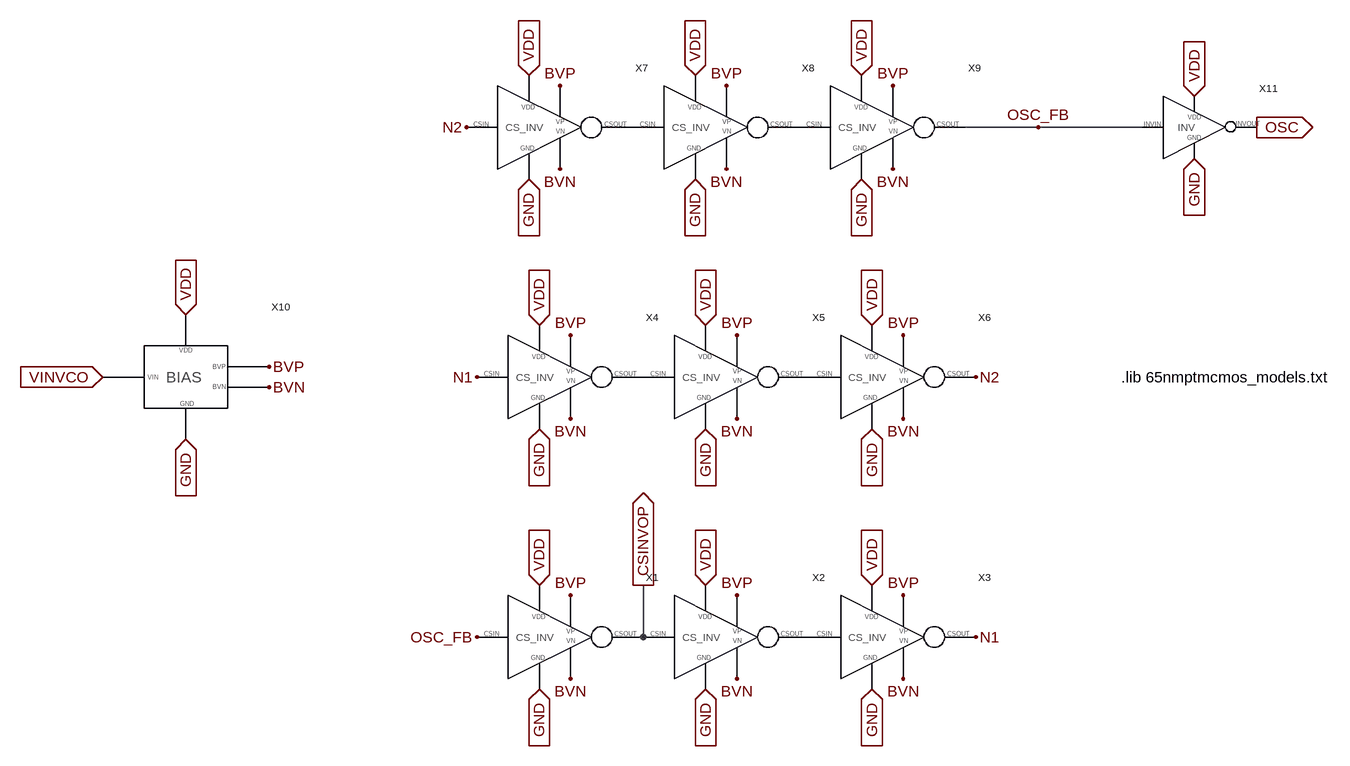
[diagram p0: schematic VCO_9.asc]
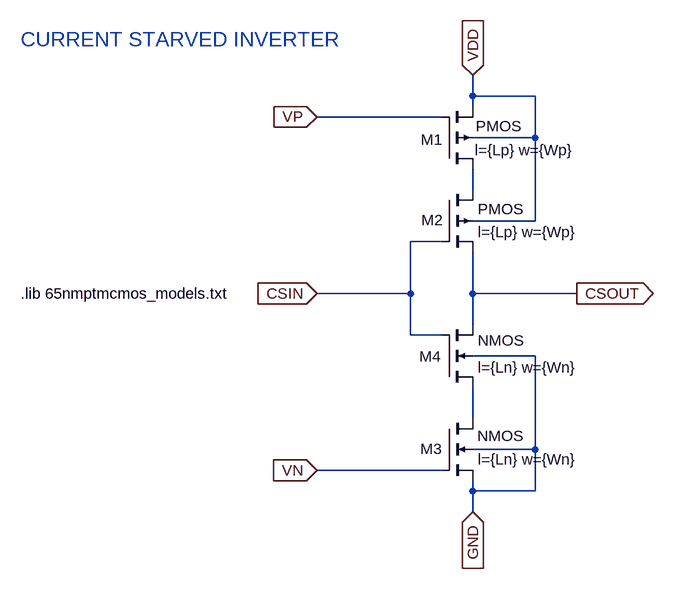
[diagram p1: sub-circuit cs_inv.asc]
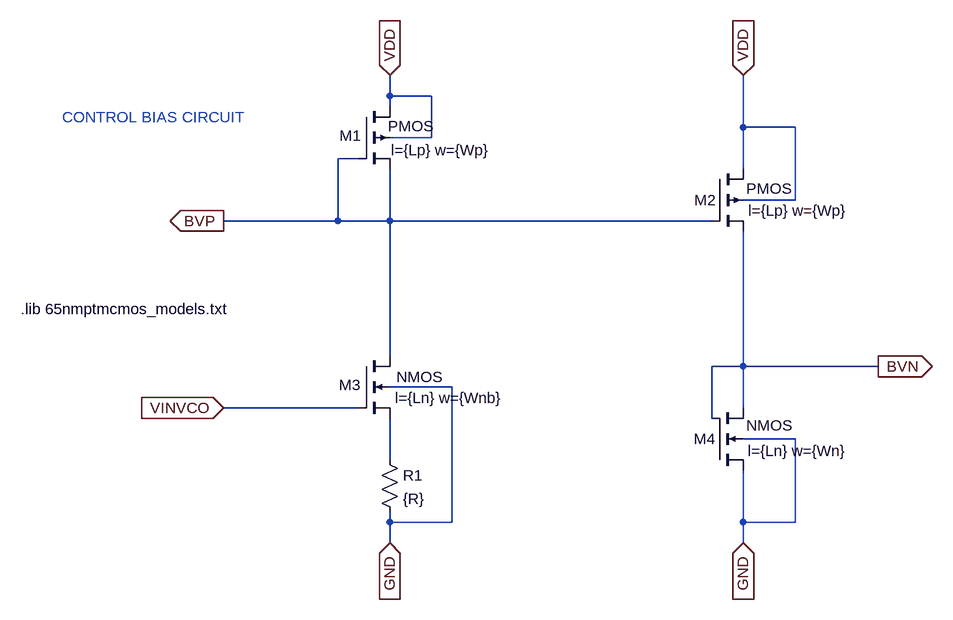
[diagram p2: sub-circuit bias.asc]
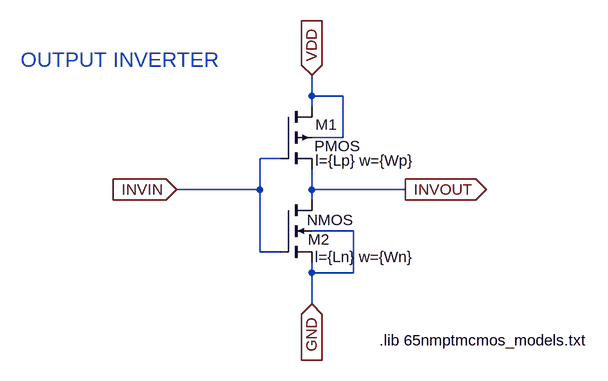
[diagram p3: sub-circuit inv.asc]
VCO_9.asc, the LTspice schematic file:
Version 4
SHEET 1 1300 688
WIRE 816 -288 704 -288
WIRE 976 -288 816 -288
WIRE 208 496 208 416
FLAG 816 -288 OSC_FB
FLAG 720 496 N1
FLAG -48 96 N1
FLAG 720 96 N2
FLAG -64 -288 N2
FLAG -48 496 OSC_FB
FLAG -368 80 BVP
FLAG 96 32 BVP
FLAG 352 32 BVP
FLAG 608 32 BVP
FLAG 592 -352 BVP
FLAG 336 -352 BVP
FLAG 80 -352 BVP
FLAG 96 432 BVP
FLAG 352 432 BVP
FLAG 608 432 BVP
FLAG -368 112 BVN
FLAG 96 160 BVN
FLAG 352 160 BVN
FLAG 608 160 BVN
FLAG 592 -224 BVN
FLAG 336 -224 BVN
FLAG 80 -224 BVN
FLAG 96 560 BVN
FLAG 352 560 BVN
FLAG 608 560 BVN
FLAG -496 192 GND
IOPIN -496 192 In
FLAG 32 -208 GND
IOPIN 32 -208 In
FLAG 288 -208 GND
IOPIN 288 -208 In
FLAG 544 -208 GND
IOPIN 544 -208 In
FLAG 1056 -240 GND
IOPIN 1056 -240 In
FLAG 48 176 GND
IOPIN 48 176 In
FLAG 304 176 GND
IOPIN 304 176 In
FLAG 560 176 GND
IOPIN 560 176 In
FLAG 560 576 GND
IOPIN 560 576 In
FLAG 304 576 GND
IOPIN 304 576 In
FLAG 48 576 GND
IOPIN 48 576 In
FLAG 32 -368 VDD
IOPIN 32 -368 In
FLAG 288 -368 VDD
IOPIN 288 -368 In
FLAG 544 -368 VDD
IOPIN 544 -368 In
FLAG 560 16 VDD
IOPIN 560 16 In
FLAG 304 16 VDD
IOPIN 304 16 In
FLAG 48 16 VDD
IOPIN 48 16 In
FLAG 48 416 VDD
IOPIN 48 416 In
FLAG 304 416 VDD
IOPIN 304 416 In
FLAG 560 416 VDD
IOPIN 560 416 In
FLAG 1056 -336 VDD
IOPIN 1056 -336 In
FLAG -496 0 VDD
IOPIN -496 0 In
FLAG 1152 -288 OSC
IOPIN 1152 -288 Out
FLAG -624 96 VINVCO
IOPIN -624 96 In
FLAG 208 416 CSINVOP
IOPIN 208 416 Out
SYMBOL CS_Inv 64 480 R0
SYMATTR InstName X1
SYMBOL CS_Inv 320 480 R0
SYMATTR InstName X2
SYMBOL CS_Inv 576 480 R0
SYMATTR InstName X3
SYMBOL CS_Inv 64 80 R0
SYMATTR InstName X4
SYMBOL CS_Inv 320 80 R0
SYMATTR InstName X5
SYMBOL CS_Inv 576 80 R0
SYMATTR InstName X6
SYMBOL CS_Inv 48 -304 R0
SYMATTR InstName X7
SYMBOL CS_Inv 304 -304 R0
SYMATTR InstName X8
SYMBOL CS_Inv 560 -304 R0
SYMATTR InstName X9
SYMBOL Bias -496 96 R0
SYMATTR InstName X10
SYMBOL Inv 1072 -288 R0
SYMATTR InstName X11
TEXT 944 96 Left 2 !.lib 65nmptmcmos_models.txt

cs_inv.asc, the sub-circuit schematic file:
Version 4
SHEET 1 1016 680
WIRE 192 -544 192 -576
WIRE 288 -544 192 -544
WIRE 192 -528 192 -544
WIRE 144 -512 -48 -512
WIRE 288 -480 288 -544
WIRE 288 -480 192 -480
WIRE 192 -400 192 -432
WIRE 288 -352 288 -480
WIRE 288 -352 192 -352
WIRE 144 -320 96 -320
WIRE 96 -240 96 -320
WIRE 96 -240 -48 -240
WIRE 192 -240 192 -304
WIRE 352 -240 192 -240
WIRE 192 -192 192 -240
WIRE 96 -176 96 -240
WIRE 144 -176 96 -176
WIRE 288 -144 192 -144
WIRE 192 -48 192 -96
WIRE 288 0 288 -144
WIRE 288 0 192 0
WIRE 144 32 -48 32
WIRE 192 64 192 48
WIRE 288 64 288 0
WIRE 288 64 192 64
WIRE 192 96 192 64
FLAG 192 -576 VDD
IOPIN 192 -576 In
FLAG 192 96 GND
IOPIN 192 96 In
FLAG -48 -240 CSIN
IOPIN -48 -240 In
FLAG 352 -240 CSOUT
IOPIN 352 -240 Out
FLAG -48 -512 VP
IOPIN -48 -512 In
FLAG -48 32 VN
IOPIN -48 32 In
SYMBOL pmos4 144 -432 M180
WINDOW 123 51 29 Left 2
WINDOW 0 -32 45 Left 2
WINDOW 3 53 66 Left 2
SYMATTR Value2 l={Lp} w={Wp}
SYMATTR InstName M1
SYMBOL pmos4 144 -400 R0
WINDOW 123 56 65 Left 2
WINDOW 0 -31 47 Left 2
WINDOW 3 56 30 Left 2
SYMATTR Value2 l={Lp} w={Wp}
SYMATTR InstName M2
SYMBOL nmos4 144 -48 R0
WINDOW 123 56 63 Left 2
WINDOW 0 -33 47 Left 2
WINDOW 3 55 27 Left 2
SYMATTR Value2 l={Ln} w={Wn}
SYMATTR InstName M3
SYMBOL nmos4 144 -96 M180
WINDOW 123 56 30 Left 2
WINDOW 0 -34 47 Left 2
SYMATTR Value2 l={Ln} w={Wn}
SYMATTR InstName M4
TEXT -504 -240 Left 2 !.lib 65nmptmcmos_models.txt
TEXT -504 -632 Left 3 ;CURRENT STARVED INVERTER

bias.asc, the sub-circuit schematic file:
Version 4
SHEET 1 1292 832
WIRE 80 32 80 0
WIRE 144 32 80 32
WIRE 80 48 80 32
WIRE 624 80 624 0
WIRE 704 80 624 80
WIRE 144 96 144 32
WIRE 144 96 80 96
WIRE 32 128 0 128
WIRE 624 144 624 80
WIRE 704 192 704 80
WIRE 704 192 624 192
WIRE 0 224 0 128
WIRE 0 224 -176 224
WIRE 80 224 80 144
WIRE 80 224 0 224
WIRE 576 224 80 224
WIRE 80 432 80 224
WIRE 624 448 624 240
WIRE 624 448 576 448
WIRE 832 448 624 448
WIRE 176 480 80 480
WIRE 32 512 -176 512
WIRE 624 512 624 448
WIRE 576 528 576 448
WIRE 704 560 624 560
WIRE 80 592 80 528
WIRE 80 688 80 672
WIRE 176 688 176 480
WIRE 176 688 80 688
WIRE 624 688 624 608
WIRE 704 688 704 560
WIRE 704 688 624 688
WIRE 80 720 80 688
WIRE 624 720 624 688
FLAG 832 448 BVN
IOPIN 832 448 Out
FLAG 80 0 VDD
IOPIN 80 0 In
FLAG 624 0 VDD
IOPIN 624 0 In
FLAG -176 224 BVP
IOPIN -176 224 Out
FLAG 80 720 GND
IOPIN 80 720 In
FLAG 624 720 GND
IOPIN 624 720 In
FLAG -176 512 VINVCO
IOPIN -176 512 In
SYMBOL res 64 576 R0
SYMATTR InstName R1
SYMATTR Value {R}
SYMBOL pmos4 32 48 R0
WINDOW 123 50 67 Left 2
WINDOW 0 -29 45 Left 2
WINDOW 3 45 30 Left 2
SYMATTR Value2 l={Lp} w={Wp}
SYMATTR InstName M1
SYMBOL pmos4 576 144 R0
WINDOW 123 56 64 Left 2
WINDOW 0 -27 48 Left 2
WINDOW 3 53 30 Left 2
SYMATTR Value2 l={Lp} w={Wp}
SYMATTR InstName M2
SYMBOL nmos4 32 432 R0
WINDOW 123 56 65 Left 2
WINDOW 0 -30 45 Left 2
WINDOW 3 58 32 Left 2
SYMATTR Value2 l={Ln} w={Wnb}
SYMATTR InstName M3
SYMBOL nmos4 576 608 M180
WINDOW 123 55 30 Left 2
WINDOW 0 -28 48 Left 2
WINDOW 3 53 69 Left 2
SYMATTR Value2 l={Ln} w={Wn}
SYMATTR InstName M4
TEXT -488 360 Left 2 !.lib 65nmptmcmos_models.txt
TEXT -424 64 Left 2 ;CONTROL BIAS CIRCUIT

inv.asc, the sub-circuit schematic file:
Version 4
SHEET 1 880 680
WIRE 224 16 224 -16
WIRE 272 16 224 16
WIRE 224 32 224 16
WIRE 272 80 272 16
WIRE 272 80 224 80
WIRE 176 112 144 112
WIRE 144 160 144 112
WIRE 144 160 16 160
WIRE 224 160 224 128
WIRE 368 160 224 160
WIRE 224 176 224 160
WIRE 288 224 224 224
WIRE 144 256 144 160
WIRE 176 256 144 256
WIRE 224 288 224 272
WIRE 288 288 288 224
WIRE 288 288 224 288
WIRE 224 336 224 288
FLAG 224 -16 VDD
IOPIN 224 -16 In
FLAG 224 336 GND
IOPIN 224 336 In
FLAG 16 160 INVIN
IOPIN 16 160 In
FLAG 368 160 INVOUT
IOPIN 368 160 Out
SYMBOL pmos4 176 32 R0
WINDOW 123 54 83 Left 2
WINDOW 0 54 28 Left 2
WINDOW 3 52 61 Left 2
SYMATTR Value2 l={Lp} w={Wp}
SYMATTR InstName M1
SYMBOL nmos4 176 176 R0
WINDOW 123 53 88 Left 2
WINDOW 0 42 61 Left 2
WINDOW 3 41 31 Left 2
SYMATTR Value2 l={Ln} w={Wn}
SYMATTR InstName M2
TEXT 328 392 Left 2 !.lib 65nmptmcmos_models.txt
TEXT -224 -40 Left 3 ;OUTPUT INVERTER

The netlist it stands for:
* VCO_9.asc
XX1 CSINVOP OSC_FB VDD GND BVP BVN cs_inv
XX2 P001 CSINVOP VDD GND BVP BVN cs_inv
XX3 N1 P001 VDD GND BVP BVN cs_inv
XX4 P002 N1 VDD GND BVP BVN cs_inv
XX5 P003 P002 VDD GND BVP BVN cs_inv
XX6 N2 P003 VDD GND BVP BVN cs_inv
XX7 P004 N2 VDD GND BVP BVN cs_inv
XX8 P005 P004 VDD GND BVP BVN cs_inv
XX9 OSC_FB P005 VDD GND BVP BVN cs_inv
XX10 VDD GND BVP BVN VINVCO bias
XX11 VDD GND OSC_FB OSC inv

* block symbol definitions
.subckt cs_inv CSOUT CSIN VDD GND VP VN
M1 N001 VP VDD VDD PMOS l={Lp} w={Wp}
M2 N001 CSIN CSOUT VDD PMOS l={Lp} w={Wp}
M3 N002 VN GND GND NMOS l={Ln} w={Wn}
M4 N002 CSIN CSOUT GND NMOS l={Ln} w={Wn}
.lib 65nmptmcmos_models.txt
* CURRENT STARVED INVERTER
.ends cs_inv

.subckt bias VDD GND BVP BVN VINVCO
R1 N001 GND {R}
M1 VDD BVP BVP VDD PMOS l={Lp} w={Wp}
M2 VDD BVP BVN VDD PMOS l={Lp} w={Wp}
M3 BVP VINVCO N001 GND NMOS l={Ln} w={Wnb}
M4 GND BVN BVN GND NMOS l={Ln} w={Wn}
.lib 65nmptmcmos_models.txt
* CONTROL BIAS CIRCUIT
.ends bias

.subckt inv VDD GND INVIN INVOUT
M1 VDD INVIN INVOUT VDD PMOS l={Lp} w={Wp}
M2 INVOUT INVIN GND GND NMOS l={Ln} w={Wn}
.lib 65nmptmcmos_models.txt
* OUTPUT INVERTER
.ends inv

.model NMOS NMOS
.model PMOS PMOS
.lib standard.mos
.lib 65nmptmcmos_models.txt
.backanno
.end